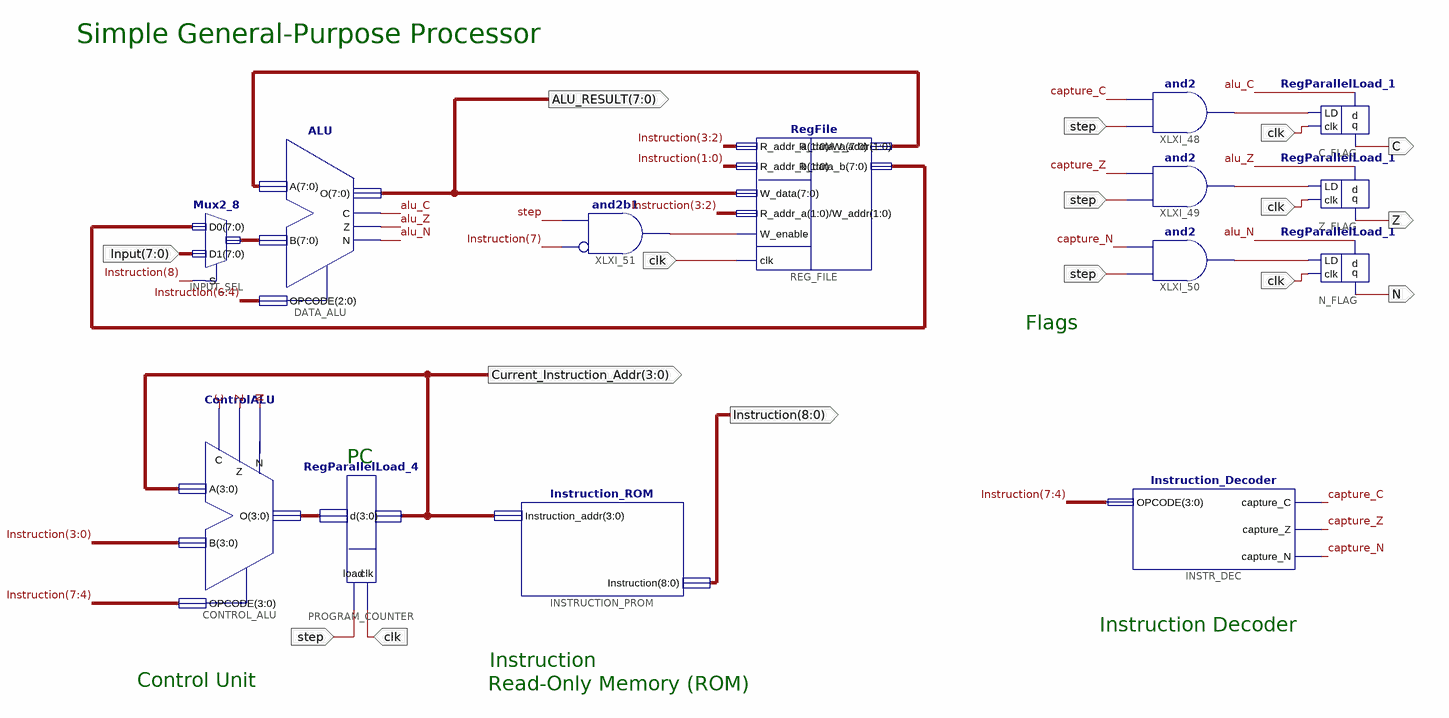
[diagram p0: schematic sheet 1]
// Xilinx ISE schematic GPP.sch (spartan3e) as structural Verilog: 14 symbols, 9 ports
module GPP (
  input  clk,
  input  step,
  input  [7:0] Input,
  output C,
  output N,
  output Z,
  output [3:0] Current_Instruction_Addr,
  output [8:0] Instruction,
  output [7:0] ALU_RESULT
);

  wire alu_C, alu_N, alu_Z, capture_C, capture_N, capture_Z, write_enable_registers, XLXN_136, XLXN_137,
       XLXN_138;
  wire [3:0] PC_NEXT;
  wire [7:0] Output_A, Output_B, XLXN_73;

  RegParallelLoad_1 Z_FLAG (.LD(XLXN_137), .clk(clk), .d(alu_Z), .q(Z));
  RegParallelLoad_1 C_FLAG (.LD(XLXN_136), .clk(clk), .d(alu_C), .q(C));
  RegParallelLoad_1 N_FLAG (.LD(XLXN_138), .clk(clk), .d(alu_N), .q(N));
  and XLXI_48 (XLXN_136, step, capture_C);
  Instruction_Decoder INSTR_DEC (
    .capture_C(capture_C), .capture_Z(capture_Z), .capture_N(capture_N), .OPCODE(Instruction[7:4]));
  ControlALU CONTROL_ALU (
    .A(Current_Instruction_Addr), .B(Instruction[3:0]), .O(PC_NEXT), .OPCODE(Instruction[7:4]), .N(N), .Z(Z),
    .C(C));
  Instruction_ROM INSTRUCTION_PROM (.Instruction_addr(Current_Instruction_Addr), .Instruction(Instruction));
  RegParallelLoad_4 PROGRAM_COUNTER (.clk(clk), .q(Current_Instruction_Addr), .load(step), .d(PC_NEXT));
  RegFile REG_FILE (
    .R_addr_b(Instruction[1:0]), .R_addr_a(Instruction[3:2]), .clk(clk), .W_data(ALU_RESULT),
    .W_addr(Instruction[3:2]), .W_enable(write_enable_registers), .R_data_a(Output_A), .R_data_b(Output_B));
  and XLXI_51 (write_enable_registers, ~Instruction[7], step);  // and2b1
  ALU DATA_ALU (.A(Output_A), .B(XLXN_73), .OPCODE(Instruction[6:4]), .C(alu_C), .Z(alu_Z), .N(alu_N), .O(ALU_RESULT));
  Mux2_8 INPUT_SEL (.O(XLXN_73), .D0(Output_B), .D1(Input), .S(Instruction[8]));
  and XLXI_49 (XLXN_137, step, capture_Z);
  and XLXI_50 (XLXN_138, step, capture_N);

  // Notes on the sheet:
  //   Simple General-Purpose Processor
  //   Flags
  //   PC
  //   Instruction Decoder
  //   Instruction
  //   Control Unit
  //   Read-Only Memory (ROM)
endmodule
